# EasyEDA schematic SCH_NodeMCU_PCB.json
TITLE: NodeMCU PCB Schematics; REV: 1.0; Date: 2019-11-08; Sheet: 1/1; Drawn By: jlaunay; Company: N/A
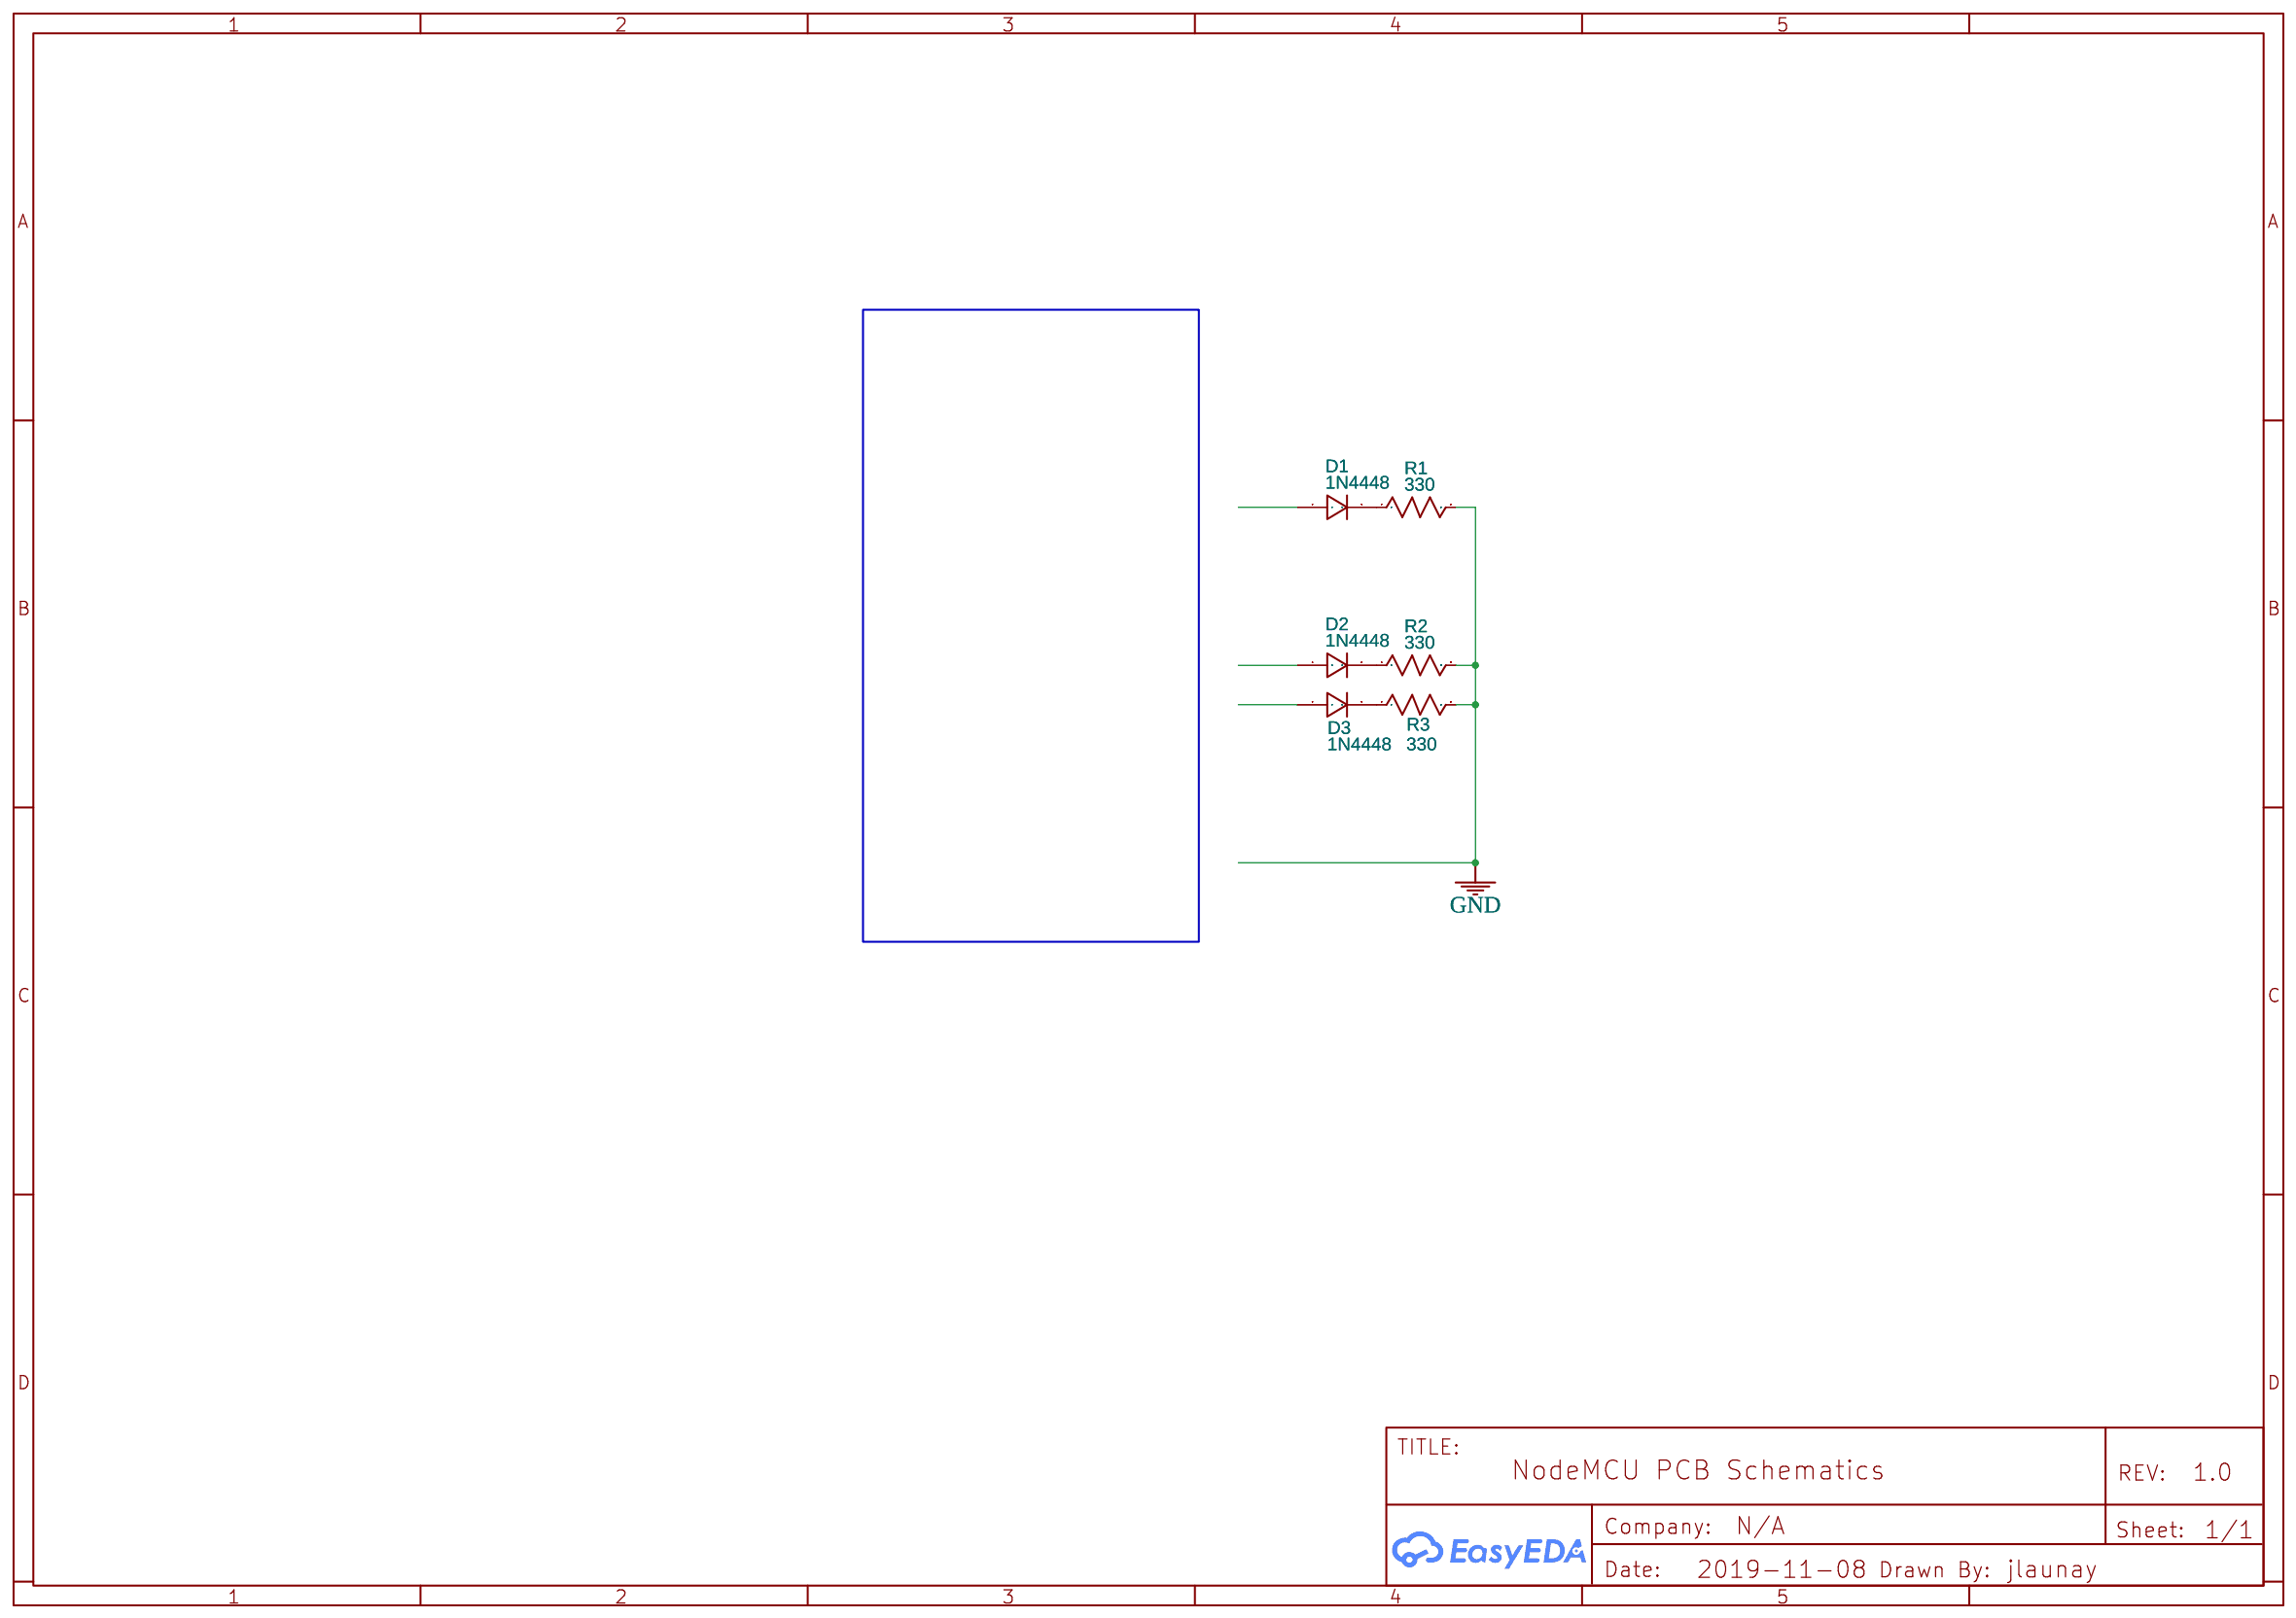
[diagram p0: schematic sheet]

## Parts
D1  1N4448  [DO-35]
D2  1N4448  [DO-35]
D3  1N4448  [DO-35]
R1  330  [AXIAL-0.3]
R2  330  [AXIAL-0.3]
R3  330  [AXIAL-0.3]

## Library data of the parts
D1-D3 = -: Supplier: LCSC; Manufacturer: SEMTECH; image: //image.lceda.cn/szlcsc/C54037.jpg; Supplier Part: C54037
R1-R3 = Res_AXIAL-0.3(1/8W)_US

## Nets
GND: R1.2 R2.2 R3.2
Net-(D1-2): D1.2(K) R1.1
Net-(D2-2): D2.2(K) R2.1
Net-(D3-2): D3.2(K) R3.1

Not connected (* = marked no-connect by the designer): D1 1(A); D2 1(A); D3 1(A)
